# Altium project cat.PrjPcb (part 2 of 6)

## Sheet radios.SchDoc: Microcontroller
size A3; SheetNumber: 2; SheetTotal: 7
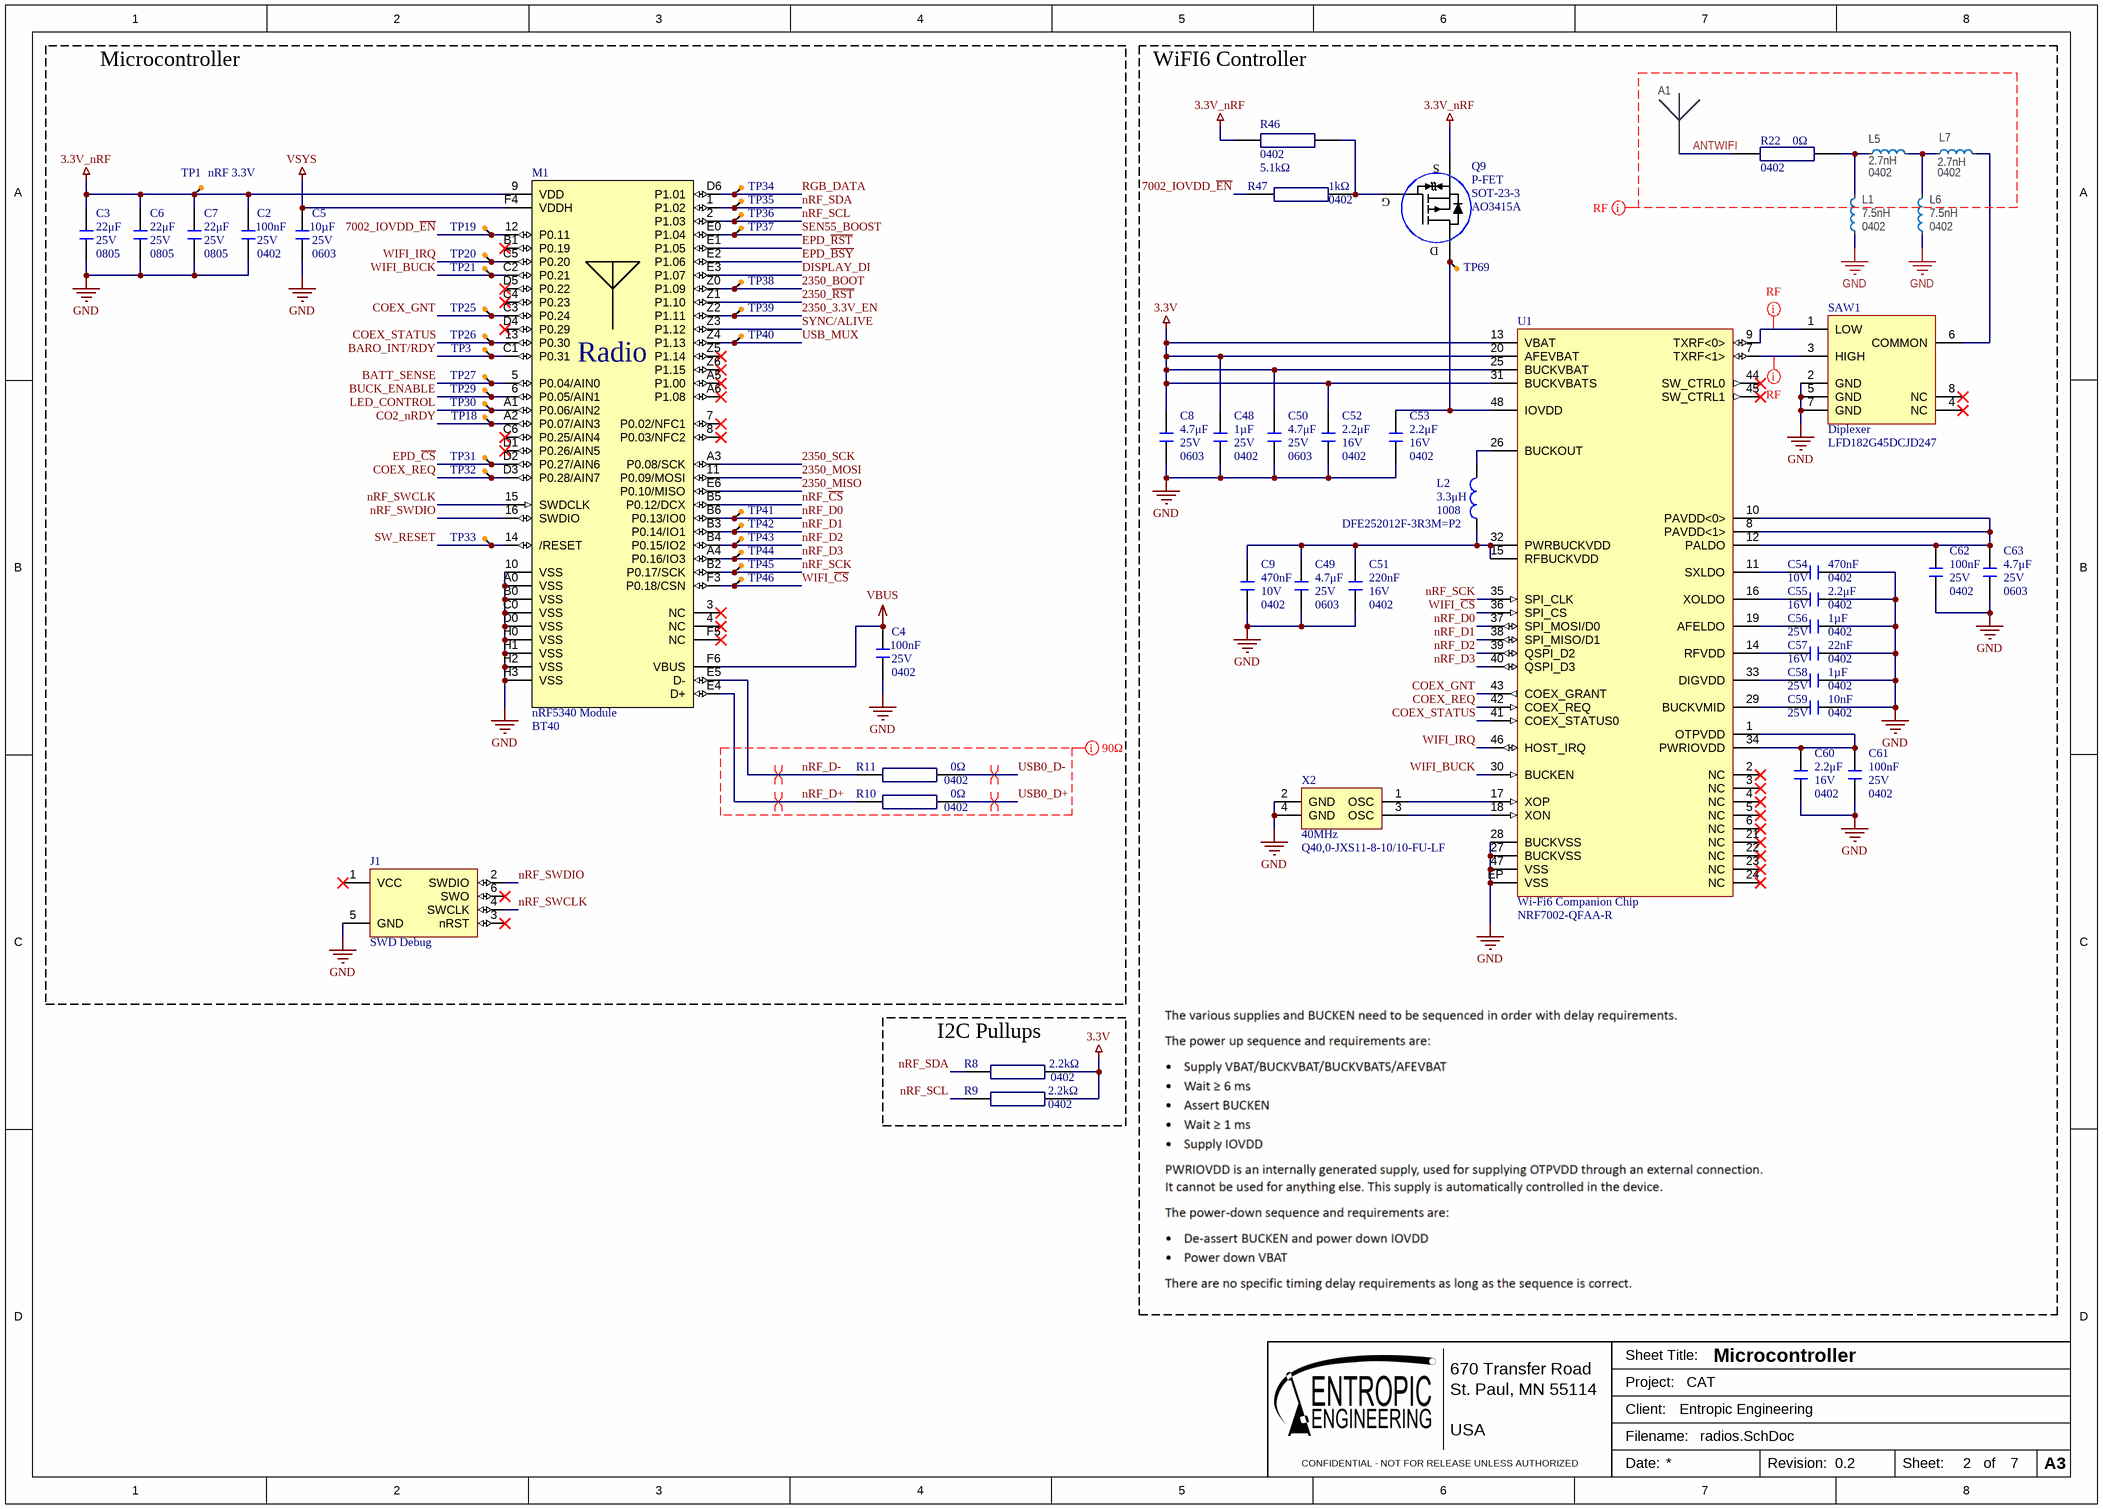
[diagram p1: radios.SchDoc]

### Parts
A1  (no value)  [NN03-320]
C2  Voltage Rating: 25V  Case Code (Imperial): 0402  Capacitance: 100nF  [0402_capacitor]  (hidden comment: GRM155R71E104KE14D)
C3  value 22μF  Rated DC Voltage (URdc): 25V  Case/Package: 0805  [0805_capacitor]  (hidden comment: GRT21BR61E226ME13L)
C4  Voltage Rating: 25V  Case Code (Imperial): 0402  Capacitance: 100nF  [0402_capacitor]  (hidden comment: GRM155R71E104KE14D)
C5  value 10µF  Voltage Rating: 25V  Case Code (Imperial): 0603  [0603_capacitor]  (hidden comment: CL10A106MA8NRNC)
C6  value 22μF  Rated DC Voltage (URdc): 25V  Case/Package: 0805  [0805_capacitor]  (hidden comment: GRT21BR61E226ME13L)
C7  value 22μF  Rated DC Voltage (URdc): 25V  Case/Package: 0805  [0805_capacitor]  (hidden comment: GRT21BR61E226ME13L)
C8  value 4.7μF  Voltage Rating: 25V  Case/Package: 0603  [0603_capacitor]  (hidden comment: C1608X5R1E475K080AC)
C9  Capacitance: 470nF  Voltage Rating: 10V  Case/Package: 0402  [0402_capacitor]  (hidden comment: CL05Y474KP5VPJC)
C48  Size Code: 0402  Capacitance: 1µF  Voltage: 25V  [0402_capacitor]  (hidden comment: GRM155R61E105KA12D)
C49  value 4.7μF  Voltage Rating: 25V  Case/Package: 0603  [0603_capacitor]  (hidden comment: C1608X5R1E475K080AC)
C50  value 4.7μF  Voltage Rating: 25V  Case/Package: 0603  [0603_capacitor]  (hidden comment: C1608X5R1E475K080AC)
C51  value 220nF  Voltage Rating: 16V  Case/Package: 0402  [0402_capacitor]  (hidden comment: GCM155R71C224KE02D)
C52  value 2.2μF  Voltage Rating: 16V  Case/Package: 0402  [0402_capacitor]  (hidden comment: GRM155D71C225ME11D)
C53  value 2.2μF  Voltage Rating: 16V  Case/Package: 0402  [0402_capacitor]  (hidden comment: GRM155D71C225ME11D)
C54  Capacitance: 470nF  Voltage Rating: 10V  Case/Package: 0402  [0402_capacitor]  (hidden comment: CL05Y474KP5VPJC)
C55  value 2.2μF  Voltage Rating: 16V  Case/Package: 0402  [0402_capacitor]  (hidden comment: GRM155D71C225ME11D)
C56  Size Code: 0402  Capacitance: 1µF  Voltage: 25V  [0402_capacitor]  (hidden comment: GRM155R61E105KA12D)
C57  value 22nF  Voltage Rating: 16V  Case/Package: 0402  [0402_capacitor]  (hidden comment: C0402C223K4RECAUTO)
C58  Size Code: 0402  Capacitance: 1µF  Voltage: 25V  [0402_capacitor]  (hidden comment: GRM155R61E105KA12D)
C59  Capacitance: 10nF  Voltage Rating: 25V  Case Code (Imperial): 0402  [0402_capacitor]  (hidden comment: CL05B103KA5NNNC)
C60  value 2.2μF  Voltage Rating: 16V  Case/Package: 0402  [0402_capacitor]  (hidden comment: GRM155D71C225ME11D)
C61  Case Code (Imperial): 0402  Voltage: 25V  Capacitance: 100nF  [0402_capacitor]  (hidden comment: GRM155R71E104KE14D)
C62  Case Code (Imperial): 0402  Voltage: 25V  Capacitance: 100nF  [0402_capacitor]  (hidden comment: GRM155R71E104KE14D)
C63  value 4.7μF  Voltage Rating: 25V  Case/Package: 0603  [0603_capacitor]  (hidden comment: C1608X5R1E475K080AC)
J1  SWD Debug  [debug_header_dual]  (no BOM)
L1  value 7.5nH  Footprint Doc: 0402  [INDC1005X04L]
L2  value 3.3μH  Case Code (Imperial): 1008  [INDC2520X12N]  (hidden comment: DFE252012F-3R3M=P2)
L5  value 2.7nH  Footprint Doc: 0402  [INDC1005X04L]
L6  value 7.5nH  Footprint Doc: 0402  [INDC1005X04L]
L7  value 2.7nH  Footprint Doc: 0402  [INDC1005X04L]
M1  nRF5340 Module  [BT40]
Q9  P-FET  Case/Package: SOT-23-3  [SOT95P280X115-3N]
R8  value 2.2kΩ  Case/Package: 0402  [0402_resistor]  (hidden comment: RC0402FR-072K2L)
R9  value 2.2kΩ  Case/Package: 0402  [0402_resistor]  (hidden comment: RC0402FR-072K2L)
R10  value 0Ω  Case/Package: 0402  [0402_resistor]  (hidden comment: RC0402FR-070RL)
R11  value 0Ω  Case/Package: 0402  [0402_resistor]  (hidden comment: RC0402FR-070RL)
R22  value 0Ω  Case/Package: 0402  [0402_resistor]  (hidden comment: RC0402FR-070RL)
R46  value 5.1kΩ  Case/Package: 0402  [0402_resistor]  (hidden comment: RC0402FR-075K1L)
R47  value 1kΩ  Case/Package: 0402  [0402_resistor]  (hidden comment: RC0402JR-071KL)
SAW1  Diplexer  [CAF-50P160X80-6N]
TP1  nRF 3.3V  [test_point-1]  (no BOM)
TP3  test_point-1  [test_point-1]  (value not drawn)  (no BOM)
TP18  test_point-1  [test_point-1]  (value not drawn)  (no BOM)
TP19  test_point-1  [test_point-1]  (value not drawn)  (no BOM)
TP20  test_point-1  [test_point-1]  (value not drawn)  (no BOM)
TP21  test_point-1  [test_point-1]  (value not drawn)  (no BOM)
TP25  test_point-1  [test_point-1]  (value not drawn)  (no BOM)
TP26  test_point-1  [test_point-1]  (value not drawn)  (no BOM)
TP27  test_point-1  [test_point-1]  (value not drawn)  (no BOM)
TP29  test_point-1  [test_point-1]  (value not drawn)  (no BOM)
TP30  test_point-1  [test_point-1]  (value not drawn)  (no BOM)
TP31  (no value)  [test_point-1]  (no BOM)
TP32  test_point-1  [test_point-1]  (value not drawn)  (no BOM)
TP33  test_point-1  [test_point-1]  (value not drawn)  (no BOM)
TP34  test_point-1  [test_point-1]  (value not drawn)  (no BOM)
TP35  test_point-1  [test_point-1]  (value not drawn)  (no BOM)
TP36  test_point-1  [test_point-1]  (value not drawn)  (no BOM)
TP37  test_point-1  [test_point-1]  (value not drawn)  (no BOM)
TP38  test_point-1  [test_point-1]  (value not drawn)  (no BOM)
TP39  test_point-1  [test_point-1]  (value not drawn)  (no BOM)
TP40  test_point-1  [test_point-1]  (value not drawn)  (no BOM)
TP41  test_point-1  [test_point-1]  (value not drawn)  (no BOM)
TP42  test_point-1  [test_point-1]  (value not drawn)  (no BOM)
TP43  test_point-1  [test_point-1]  (value not drawn)  (no BOM)
TP44  test_point-1  [test_point-1]  (value not drawn)  (no BOM)
TP45  test_point-1  [test_point-1]  (value not drawn)  (no BOM)
TP46  test_point-1  [test_point-1]  (value not drawn)  (no BOM)
TP69  nRF IOVDD  [test_point-1]  (value not drawn)  (no BOM)
U1  Wi-Fi6 Companion Chip  [QFN40P600X600X60-48N]
X2  40MHz  [1612_CRYSTAL]

### Blocks framed on the sheet
Microcontroller: C2-C7 J1 M1 R10 R11 TP1 TP3 TP18-TP21 TP25-TP27 TP29-TP46
WiFI6 Controller: A1 C8 C9 C48-C63 L1 L2 L5-L7 Q9 R22 R46 R47 SAW1 TP69 U1 X2
I2C Pullups: R8 R9

### Nets
3.3V: C8.2 C48.2 C50.2 C52.2 R8.1 R9.1 U1.13(VBAT) U1.20(AFEVBAT) U1.25(BUCKVBAT) U1.31(BUCKVBATS)
3.3V_nRF: C2.1 C3.2 C6.2 C7.2 M1.9(VDD) Q9.2(S) R46.2 TP1.1
GND: C2.2 C3.1 C4.2 C5.1 C6.1 C7.1 C8.1 C9.2 C48.1 C49.1 C50.1 C51.1 C52.1 C53.1 C54.1 C55.1 C56.1 C57.2 C58.1 C59.1 C60.1 C61.2 C62.2 C63.1 J1.5(GND) L1.1 L6.1 M1.10(VSS) M1.A0(VSS) M1.B0(VSS) M1.C0(VSS) M1.D0(VSS) M1.H0(VSS) M1.H1(VSS) M1.H2(VSS) M1.H3(VSS) SAW1.2(GND) SAW1.5(GND) SAW1.7(GND) U1.27(BUCKVSS) U1.28(BUCKVSS) U1.47(VSS) U1.EP(VSS) X2.2(GND) X2.4(GND)
VBUS: C4.1 M1.F6(VBUS)
VSYS: C5.2 M1.F4(VDDH)
2350_3.3V_EN: M1.Z2(P1.11) TP39.1
2350_BOOT: M1.Z0(P1.09) TP38.1
2350_MISO: M1.E6(P0.10/MISO)
2350_MOSI: M1.11(P0.09/MOSI)
2350_~{RST}: M1.Z1(P1.10)
2350_SCK: M1.A3(P0.08/SCK)
7002_IOVDD_~{EN}: M1.12(P0.11) R47.1 TP19.1
ANTWIFI: A1.4(Feed1) R22.2
BARO_INT/RDY: M1.C1(P0.31) TP3.1
BATT_SENSE: M1.5(P0.04/AIN0) TP27.1
BUCK_ENABLE: M1.6(P0.05/AIN1) TP29.1
CO2_nRDY: M1.A2(P0.07/AIN3) TP18.1
COEX_GNT: M1.C3(P0.24) TP25.1 U1.43(COEX_GRANT)
COEX_REQ: M1.D3(P0.28/AIN7) TP32.1 U1.42(COEX_REQ)
COEX_STATUS: M1.13(P0.30) TP26.1 U1.41(COEX_STATUS0)
DISPLAY_DI: M1.E3(P1.07)
EPD_~{BSY}: M1.E2(P1.06)
EPD_~{CS}: M1.D2(P0.27/AIN6) TP31.1
EPD_~{RST}: M1.E1(P1.05)
LED_CONTROL: M1.A1(P0.06/AIN2) TP30.1
nRF_~{CS}: M1.B5(P0.12/DCX)
nRF_D0: M1.B6(P0.13/IO0) TP41.1 U1.37(SPI_MOSI/D0)
nRF_D1: M1.B3(P0.14/IO1) TP42.1 U1.38(SPI_MISO/D1)
nRF_D2: M1.B4(P0.15/IO2) TP43.1 U1.39(QSPI_D2)
nRF_D3: M1.A4(P0.16/IO3) TP44.1 U1.40(QSPI_D3)
nRF_D+: M1.E4(D+) R10.2
nRF_D-: M1.E5(D-) R11.2
nRF_SCK: M1.B2(P0.17/SCK) TP45.1 U1.35(SPI_CLK)
nRF_SCL: M1.2(P1.03) R9.2 TP36.1
nRF_SDA: M1.1(P1.02) R8.2 TP35.1
nRF_SWCLK: J1.4(SWCLK) M1.15(SWDCLK)
nRF_SWDIO: J1.2(SWDIO) M1.16(SWDIO)
RGB_DATA: M1.D6(P1.01) TP34.1
SEN55_BOOST: M1.E0(P1.04) TP37.1
SW_RESET: M1.14(/RESET) TP33.1
SYNC/ALIVE: M1.Z3(P1.12)
USB0_D+: R10.1
USB0_D-: R11.1
USB_MUX: M1.Z4(P1.13) TP40.1
WIFI_BUCK: M1.C2(P0.21) TP21.1 U1.30(BUCKEN)
WIFI_~{CS}: M1.F3(P0.18/CSN) TP46.1 U1.36(SPI_CS)
WIFI_IRQ: M1.C5(P0.20) TP20.1 U1.46(HOST_IRQ)
NetC9_1: C9.1 C49.2 C51.2 L2.1 U1.15(RFBUCKVDD) U1.32(PWRBUCKVDD)
NetC53_2: C53.2 Q9.3(D) TP69.1 U1.48(IOVDD)
NetC54_2: C54.2 U1.11(SXLDO)
NetC55_2: C55.2 U1.16(XOLDO)
NetC56_2: C56.2 U1.19(AFELDO)
NetC57_1: C57.1 U1.14(RFVDD)
NetC58_2: C58.2 U1.33(DIGVDD)
NetC59_2: C59.2 U1.29(BUCKVMID)
NetC60_2: C60.2 C61.1 U1.1(OTPVDD) U1.34(PWRIOVDD)
NetC62_1: C62.1 C63.2 U1.8(PAVDD<1>) U1.10(PAVDD<0>) U1.12(PALDO)
NetL1_2: L1.2 L5.1 R22.1
NetL2_2: L2.2 U1.26(BUCKOUT)
NetL5_2: L5.2 L6.2 L7.1
NetL7_2: L7.2 SAW1.6(COMMON)
NetQ9_1: Q9.1(G) R46.1 R47.2
NetSAW1_1: SAW1.1(LOW) U1.9(TXRF<0>)
NetSAW1_3: SAW1.3(HIGH) U1.7(TXRF<1>)
NetU1_17: U1.17(XOP) X2.1(OSC)
NetU1_18: U1.18(XON) X2.3(OSC)

Not connected (* = marked no-connect by the designer): A1 1(NC) 2(GND) 3(Feed2); J1 1(VCC)* 3(nRST)* 6(SWO)*; M1 3(NC)* 4(NC)* 7(P0.02/NFC1)* 8(P0.03/NFC2)* A5(P1.00)* A6(P1.08)* B1(P0.19)* C4(P0.23)* C6(P0.25/AIN4)* D1(P0.26/AIN5)* D4(P0.29)* D5(P0.22)* F5(NC)* Z5(P1.14)* Z6(P1.15)*; SAW1 4(NC)* 8(NC)*; U1 2(NC)* 3(NC)* 4(NC)* 5(NC)* 6(NC)* 21(NC)* 22(NC)* 23(NC)* 24(NC)* 44(SW_CTRL0)* 45(SW_CTRL1)*

### Layout directives
differential pair; differential pair class USB_DIFF: nRF_D+, nRF_D-, USB0_D+, USB0_D-
net class 90_OHM: nRF_D+, nRF_D-, USB0_D+, USB0_D-
net class RF: ANTWIFI, NetSAW1_1, NetSAW1_3

### Notes on the sheet
- 670 Transfer Road
- St. Paul, MN 55114
- Sheet Title:
- Project:
- CONFIDENTIAL - NOT FOR RELEASE UNLESS AUTHORIZED
- USA
- Client:
- Filename:
- Date:
- Revision:
- Sheet:
- of
- A3
- (in symbol BT40) Radio

### Library data of the parts
A1 = NN03-320: Dual-Band GNSS and Wi-Fi/BluetoothAntenna; Manufacturer: Ignion; Part number NEMS: 100700066; Component Status: Active; Pad Count: 4; Note: N.A.; Part Number: NN03-320; Component Class: Antennas; Author: rubr; Manufacturer Part Number: NN03-320; ComponentLink1URL: https://ignion.io/files/DS_NN03-320.pdf; ComponentLink1Description: Datasheet; ComponentLink2URL: https://ignion.io/product/duo-mxtend/; ComponentLink2Description: Supplier link; HelpURL: https://ignion.io/files/UM_NN03-320.pdf; LatestRevisionDate: 2021-12-10; Published: 2023-01-31; Footprint Doc: NN03-320; Value: NN03-320; Supplier 1: Digi-Key; Supplier Part Number 1: 2115-NN03-320CT-ND; Supplier 2: Mouser; Supplier Part Number 2: 128-NN03-320; Artikkelnr Noca: N.A.; Part number IPS: N.A.; Part number Norautron: N.A.; PartId: 100700066
C2 C4 = GRM155R71E104KE14D: 100 nF, 25 V, X7R, 0402 Chip capacitor; Manufacturer: Murata; house_part_number: C-100nF-0402-002; Tolerance: 10%; Dielectric Material: Ceramic; Supplier 1: Digi-Key; Supplier Part Number 1: 490-10698-1-ND; RoHS: Yes; Category: Ceramic Capacitors; Case/Package: 0402; Case Code (Metric): 1005; Min Operating Temperature: -55°C; Max Operating Temperature: 125°C; Packaging: Tape and Reel; RoHS Compliant: Yes; ComponentLink1URL: http://www.farnell.com/datasheets/1872206.pdf?src-supplier=Farnell; ComponentLink1Description: http://www.farnell.com/datasheets/1872206.pdf?src-supplier=Farnell; Manufacturer Part Number: GRM155R71E104KE14D; Height: 0.5mm; Lead Free: Lead Free; Pricing 1: 1=0.10000, 10=0.02700, 50=0.01460, 100=0.01190, 500=0.00848, 1000=0.00666, 2500=0.00605, 5000=0.00557 (USD); Mount: Surface Mount; Weight: 0.000212oz; Dielectric: X7R; Termination: SMD/SMT; Resistor Type: Ceramic; Voltage Rating (DC): 25V; Package Quantity: 10000; Length: 1mm; Width: 0.02inch; Thickness: 0.022inch; Depth: 0.5mm; REACH SVHC: Unknown; ComponentLink2URL: http://components.arrow.com/part/dataview/0323_06361249?src-supplier=Arrow+Europe; ComponentLink2Description: http://components.arrow.com/part/dataview/0323_06361249?src-supplier=Arrow+Europe; ComponentLink3URL: http://uk.rs-online.com/webdocs/144c/0900766b8144c113.pdf?src-supplier=RSComponents; ComponentLink3Description: http://uk.rs-online.com/webdocs/144c/0900766b8144c113.pdf?src-supplier=RSComponents; ComponentLink4URL: http://www.farnell.com/datasheets/2048008.pdf?src-supplier=Farnell; ComponentLink4Description: http://www.farnell.com/datasheets/2048008.pdf?src-supplier=Farnell; ComponentLink5URL: http://www.mouser.com/ds/2/281/c02e-2905.pdf?src-supplier=Mouser; ComponentLink5Description: http://www.mouser.com/ds/2/281/c02e-2905.pdf?src-supplier=Mouser; ComponentLink6URL: http://www.farnell.com/datasheets/2048008.pdf?src-supplier=Newark; ComponentLink6Description: http://www.farnell.com/datasheets/2048008.pdf?src-supplier=Newark; ComponentLink7URL: https://search.murata.co.jp/Ceramy/image/img/A01X/G101/ENG/GRM155R71E104KE14-01.pdf?src-supplier=Digi-Key; ComponentLink7Description: https://search.murata.co.jp/Ceramy/image/img/A01X/G101/ENG/GRM155R71E104KE14-01.pdf?src-supplier=Digi-Key; ComponentLink8URL: http://www.farnell.com/datasheets/2048008.pdf?src-supplier=Element14; ComponentLink8Description: http://www.farnell.com/datasheets/2048008.pdf?src-supplier=Element14; ComponentLink9URL: http://psearch.en.murata.com/capacitor/product/GRM155R71E104KE14%23.pdf?src-supplier=Avnet; ComponentLink9Description: http://psearch.en.murata.com/capacitor/product/GRM155R71E104KE14%23.pdf?src-supplier=Avnet
C3 C6 C7 = GRT21BR61E226ME13L: 22 μF, 25 V, X5R, 0805 Chip capacitor; Manufacturer: Murata; Dielectric Material: Ceramic; Multilayer: Yes; Tolerance  (fill in as +-): 20%; Reference Standard: AEC-Q200; Supplier 1: Digi-Key; RoHS: Yes; Category: Ceramic Capacitors; Stock 1: 1983731; Pricing 1: 1=0.48, 10=0.338, 50=0.2558, 100=0.2228, 500=0.16508, 1000=0.14031 (USD); Mounting Technology: Surface Mount; Pins: 2; Package Shape: Rectangular; Terminal Finish: Nickel; Min Operating Temperature: -55°C; Max Operating Temperature: 85°C; JESD-609 Code: e3; Capacitor Type: Ceramic; Packaging: Tape and Reel; Tolerance (fill in as +-): 20%; Temperature Characteristics Code: X5R; Termination: Wraparound; Reach SVHC Compliant: Yes; RoHS Compliant: Yes; ComponentLink1URL: https://datasheet.ciiva.com:443/pdfs/VipMasterIC/IC/MURE/MURE-S-A0004410517/MURE-S-A0004413512-1.pdf?src-supplier=IHS+Markit; ComponentLink1Description: https://datasheet.ciiva.com:443/pdfs/VipMasterIC/IC/MURE/MURE-S-A0004410517/MURE-S-A0004413512-1.pdf?src-supplier=IHS+Markit; ComponentLink2URL: http://search.murata.co.jp/Ceramy/image/img/A01X/G101/ENG/GRT21BR61E226ME13-01.pdf?src-supplier=Digi-Key; ComponentLink2Description: http://search.murata.co.jp/Ceramy/image/img/A01X/G101/ENG/GRT21BR61E226ME13-01.pdf?src-supplier=Digi-Key; Manufacturer Part Number: GRT21BR61E226ME13L; Supplier Part Number 1: 490-12389-1-ND
C5 = CL10A106MA8NRNC: 10 µF, 25 V, X5R, 0603 Chip capacitor; Manufacturer: Samsung; house_part_number: C-10uF-0603-002; Tolerance: 20%; Material: 4241ConductorMaterial; Supplier 1: Arrow Electronics; Supplier Part Number 1: CL10A106MA8NRNC; RoHS: Yes; Category: Ceramic Capacitors; Case/Package: 0603; Case Code (Metric): 1608; Min Operating Temperature: -55°C; Max Operating Temperature: 85°C; Packaging: Cut Tape; RoHS Compliant: Yes; ComponentLink1URL: https://datasheet.ciiva.com/25766/cl10a106ma8nrnc-25766562.pdf?src-supplier=Digikey; ComponentLink1Description: https://datasheet.ciiva.com/25766/cl10a106ma8nrnc-25766562.pdf?src-supplier=Digikey; Manufacturer Part Number: CL10A106MA8NRNC; Stock: 632000; Pricing: 4000=0.0511, 8000=0.046, 12000=0.0434, 28000=0.0413, 100000=0.0356 (USD); Mounting Technology: Surface Mount; Series: CL; Height: 900um; Lead Free: Lead Free
C8 C49 C50 C63 = C1608X5R1E475K080AC: 4.7 μF, 25 V, X7R, 0603 Chip capacitor; Manufacturer: TDK; Material: Ceramic; Tolerance: 10%; Dielectric: X5R; Manufacturer Part Number: C1608X5R1E475K080AC; RoHS: Yes; Category: Ceramic Capacitors; Stock: 1983872; Pricing: 1=0.16, 10=0.104, 50=0.0732, 100=0.0592, 500=0.04396, 1000=0.03847, 4000=0.03389, 8000=0.03225 (USD); Mounting Technology: Surface Mount; Case Code (Metric): 1608; Case Code (Imperial): 0603; Min Operating Temperature: -55°C; Max Operating Temperature: 85°C; Packaging: Tape and Reel; Package Quantity: 4000; Series: C; Construction: Flat; Length: 1.6mm; Width: 0.031inch; Height: 0.8mm; Thickness: 0.039inch; Depth: 0.8mm; RoHS Compliant: Yes; Lead Free: Lead Free; ComponentLink1URL: https://datasheet.ciiva.com/48671/mlcc-commercial-general-en-48671304.pdf?src-supplier=Avnet; ComponentLink1Description: https://datasheet.ciiva.com/48671/mlcc-commercial-general-en-48671304.pdf?src-supplier=Avnet; ComponentLink2URL: https://datasheet.ciiva.com/24216/mlcc-commercial-general-en-24216326.pdf?src-supplier=Mouser; ComponentLink2Description: https://datasheet.ciiva.com/24216/mlcc-commercial-general-en-24216326.pdf?src-supplier=Mouser; Supplier: Digikey; Supplier Part Number: 445-9050-1-ND; Weight: 7.1E-05oz; Dielectric Material: Ceramic; Voltage Rating (DC): 25V; Termination: SMD/SMT; Reach SVHC Compliant: Unknown; ComponentLink3URL: https://datasheet.ciiva.com/48587/6print-detail-pdf-phplangenpart-noc1608x5r1e475k080acimp-unit-xmhz-48587141.pdf?src-supplier=Onlinecomponents.com; ComponentLink3Description: https://datasheet.ciiva.com/48587/6print-detail-pdf-phplangenpart-noc1608x5r1e475k080acimp-unit-xmhz-48587141.pdf?src-supplier=Onlinecomponents.com
C9 C54 = CL05Y474KP5VPJC: 470 nF, 10 V, X7S, 0402 Chip capacitor; Manufacturer: Samsung; Supplier: Digikey; Supplier Part Number: 1276-CL05Y474KP5VPJCCT-ND; Manufacturer Part Number: CL05Y474KP5VPJC; RoHS: No; Category: Ceramic Capacitors; Stock: 27105; Pricing: 1=0.23, 10=0.15, 50=0.105, 100=0.0848, 500=0.06298, 1000=0.0551, 2500=0.05248, 5000=0.04854 (USD)
C48 C56 C58 = GRM155R61E105KA12D: 1 µF, 25 V, X5R, 0402 Chip capacitor; Manufacturer: Murata; house_part_number: C-1uF-0402-002; Dielectric Material: Ceramic; Multilayer: Yes; Negative Tolerance: 10%; Supplier 1: Digi-Key; Supplier Part Number 1: 490-10017-1-ND; RoHS: Yes; Category: Ceramic Capacitors; Stock 1: 145965; Pricing 1: 1=0.11000, 10=0.08300, 50=0.04560, 100=0.03720, 500=0.02656, 1000=0.02087, 2500=0.01898, 5000=0.01746 (USD); Mount: Surface Mount; Number of Pins: 2; Package Shape: Rectangular; Terminal Finish: Nickel; Min Operating Temperature: -55°C; Max Operating Temperature: 85°C; JESD-609 Code: e3; Capacitor Type: Ceramic; Package Style: SMTMeter; Packaging: Tape and Reel; Positive Tolerance: 10%; Temperature Characteristics Code: X5R; Termination: Wraparound; Length: 1mm; Width: 0.5mm; Height: 0.5mm; REACH SVHC: Yes; RoHS Compliant: Yes; ComponentLink1URL: https://datasheet.ciiva.com:443/pdfs/VipMasterIC/IC/MURE/MURE-S-A0004362469/MURE-S-A0004364524-1.pdf?src-supplier=IHS+Markit; ComponentLink1Description: https://datasheet.ciiva.com:443/pdfs/VipMasterIC/IC/MURE/MURE-S-A0004362469/MURE-S-A0004364524-1.pdf?src-supplier=IHS+Markit; ComponentLink2URL: https://datasheet.ciiva.com/7719/1666664-7719006.pdf?src-supplier=Element14; ComponentLink2Description: https://datasheet.ciiva.com/7719/1666664-7719006.pdf?src-supplier=Element14; ComponentLink3URL: https://datasheet.ciiva.com/22732/1666664-22732122.pdf?src-supplier=Element14; ComponentLink3Description: https://datasheet.ciiva.com/22732/1666664-22732122.pdf?src-supplier=Element14; Manufacturer Part Number: GRM155R61E105KA12D
C51 = GCM155R71C224KE02D: 220 nF, 16 V, X7R, 0402 Chip capacitor; Manufacturer: Murata; Material: Ceramic; Tolerance: 10%; Supplier: Future Electronics; Supplier Part Number: 7050660; Manufacturer Part Number: GCM155R71C224KE02D; RoHS: Yes; Category: Ceramic Capacitors; Stock: 80000; Pricing: 10000=0.0082, 30000=0.0079, 50000=0.0078, 150000=0.0076, 250000=0.0074 (USD); Mounting Technology: Surface Mount; Case Code (Metric): 1005; Case Code (Imperial): 0402; Weight: 0.000212oz; Min Operating Temperature: -55°C; Max Operating Temperature: 125°C; Packaging: Tape and Reel; Dielectric: X7R; Termination: SMD/SMT; Voltage Rating (DC): 16V; Package Quantity: 10000; Series: GCM; Length: 0.039inch; Width: 0.02inch; Height: 0.5mm; Thickness: 0.022inch; Ratings: AEC-Q200; Lead Free: Lead Free; RoHS Compliant: Yes; ComponentLink1URL: http://www.mouser.com/ds/2/281/c03e-806517.pdf?src-supplier=Mouser; ComponentLink1Description: http://www.mouser.com/ds/2/281/c03e-806517.pdf?src-supplier=Mouser; ComponentLink2URL: http://search.murata.co.jp/Ceramy/image/img/A01X/partnumbering_e_02.pdf?src-supplier=Digikey; ComponentLink2Description: http://search.murata.co.jp/Ceramy/image/img/A01X/partnumbering_e_02.pdf?src-supplier=Digikey; ComponentLink3URL: https://datasheet.octopart.com/GCM155R71C224KE02D-Murata-datasheet-32042419.pdf?src-supplier=Future+Electronics; ComponentLink3Description: https://datasheet.octopart.com/GCM155R71C224KE02D-Murata-datasheet-32042419.pdf?src-supplier=Future+Electronics; ComponentLink4URL: https://datasheet.octopart.com/GCM155R71C224KE02D-Murata-datasheet-149522429.pdf?src-supplier=Newark; ComponentLink4Description: https://datasheet.octopart.com/GCM155R71C224KE02D-Murata-datasheet-149522429.pdf?src-supplier=Newark; ComponentLink5URL: https://datasheet.octopart.com/GCM155R71C224KE02D-Murata-datasheet-12511495.pdf?src-supplier=TME; ComponentLink5Description: https://datasheet.octopart.com/GCM155R71C224KE02D-Murata-datasheet-12511495.pdf?src-supplier=TME
C52 C53 C55 C60 = GRM155D71C225ME11D: 2.2 µF, 16 V, X7T, 0402 Chip capacitor; Manufacturer: Murata; Material: Ceramic; Tolerance: 20%; Supplier: Future Electronics; Supplier Part Number: 9135167; Manufacturer Part Number: GRM155D71C225ME11D; RoHS: Yes; Category: Ceramic Capacitors; Stock: 10000; Pricing: 10000=0.0274, 20000=0.027, 30000=0.0267, 40000=0.0266, 50000=0.026 (USD); Min Operating Temperature: -55°C; Max Operating Temperature: 125°C; Dielectric: X7T; Voltage Rating (DC): 16V; Length: 1mm; Width: 500um; Height: 650um; Thickness: 500um; RoHS Compliant: Yes; ComponentLink1URL: https://datasheet.octopart.com/GRM155D71C225ME11D-Murata-datasheet-165579666.pdf?src-supplier=TME; ComponentLink1Description: https://datasheet.octopart.com/GRM155D71C225ME11D-Murata-datasheet-165579666.pdf?src-supplier=TME
C57 = C0402C223K4RECAUTO: 22 nF, 16 V, X7R, 0402 Chip capacitor; Manufacturer: KEMET; Tolerance: 10%; Supplier: Mouser; Supplier Part Number: 80-C0402C223K4RECAUT; Manufacturer Part Number: C0402C223K4RECAUTO; RoHS: Yes; Category: Ceramic Capacitors; Stock: 25248; Pricing: 1=0.13, 10=0.054, 50=0.054, 100=0.031, 1000=0.027, 10000=0.023 (USD); Mounting Technology: Surface Mount; Case Code (Imperial): 0402; Case Code (Metric): 1005; Min Operating Temperature: -55°C; Max Operating Temperature: 125°C; Packaging: Cut Tape; Series: C; Dielectric: X7R; Voltage Rating (DC): 16V; Ratings: AEC-Q200; RoHS Compliant: Yes; ComponentLink1URL: https://api.kemet.com/component-edge/download/datasheet/C0402C223K4RECAUTO.pdf?src-supplier=Digikey; ComponentLink1Description: https://api.kemet.com/component-edge/download/datasheet/C0402C223K4RECAUTO.pdf?src-supplier=Digikey; ComponentLink2URL: https://datasheet.octopart.com/C0402C223K4RECAUTO-KEMET-datasheet-153706760.pdf?src-supplier=Electro+Sonic; ComponentLink2Description: https://datasheet.octopart.com/C0402C223K4RECAUTO-KEMET-datasheet-153706760.pdf?src-supplier=Electro+Sonic
C59 = CL05B103KA5NNNC: 10 nF, 25 V, X7R, 0402 Chip capacitor; Manufacturer: Samsung; house_part_number: C-10nF-0402-002; Tolerance: 10%; Supplier 1: Digi-Key; Supplier Part Number 1: 1276-1057-2-ND; RoHS: Yes; Category: Ceramic Capacitors; Stock 1: 2318300; Pricing 1: 10000=0.00328, 20000=0.00312, 30000=0.00297, 50000=0.00266, 100000=0.00215, 250000=0.00195 (USD); Mount: Surface Mount; Case/Package: 0402; Case Code (Metric): 1005; Contact Plating: Tin; Min Operating Temperature: -55°C; Max Operating Temperature: 125°C; Packaging: Tape and Reel; Package Quantity: 1; Dielectric: X7R; Series: CL; Construction: Flat; Length: 1mm; Width: 0.02inch; Height: 0.5mm; Thickness: 0.022inch; Depth: 0.5mm; Radiation Hardening: No; RoHS Compliant: Yes; ComponentLink1URL: https://datasheet.ciiva.com/15195/getdatasheetpartid-358612-15195635.pdf?src-supplier=Verical; ComponentLink1Description: https://datasheet.ciiva.com/15195/getdatasheetpartid-358612-15195635.pdf?src-supplier=Verical; ComponentLink2URL: https://datasheet.ciiva.com/16740/cl05b104kq5nnnc-16740683.pdf?src-supplier=Future+Electronics; ComponentLink2Description: https://datasheet.ciiva.com/16740/cl05b104kq5nnnc-16740683.pdf?src-supplier=Future+Electronics; Manufacturer Part Number: CL05B103KA5NNNC
C61 C62 = GRM155R71E104KE14D: 100 nF, 25 V, X7R, 0402 Chip capacitor; Manufacturer: Murata; house_part_number: C-100nF-0402-002; Dielectric Material: Ceramic; Tolerance: 10%; Supplier 1: Digi-Key; Supplier Part Number 1: 490-10698-1-ND; RoHS: Yes; Category: Ceramic Capacitors; Pricing 1: 1=0.10000, 10=0.02700, 50=0.01460, 100=0.01190, 500=0.00848, 1000=0.00666, 2500=0.00605, 5000=0.00557 (USD); Mount: Surface Mount; Case/Package: 0402; Case Code (Metric): 1005; Weight: 0.000212oz; Min Operating Temperature: -55°C; Max Operating Temperature: 125°C; Packaging: Tape and Reel; Voltage Rating: 25V; Dielectric: X7R; Termination: SMD/SMT; Resistor Type: Ceramic; Voltage Rating (DC): 25V; Package Quantity: 10000; Length: 1mm; Width: 0.02inch; Height: 0.5mm; Thickness: 0.022inch; Depth: 0.5mm; REACH SVHC: Unknown; Lead Free: Lead Free; RoHS Compliant: Yes; ComponentLink1URL: http://www.farnell.com/datasheets/1872206.pdf?src-supplier=Farnell; ComponentLink1Description: http://www.farnell.com/datasheets/1872206.pdf?src-supplier=Farnell; ComponentLink2URL: http://components.arrow.com/part/dataview/0323_06361249?src-supplier=Arrow+Europe; ComponentLink2Description: http://components.arrow.com/part/dataview/0323_06361249?src-supplier=Arrow+Europe; ComponentLink3URL: http://uk.rs-online.com/webdocs/144c/0900766b8144c113.pdf?src-supplier=RSComponents; ComponentLink3Description: http://uk.rs-online.com/webdocs/144c/0900766b8144c113.pdf?src-supplier=RSComponents; ComponentLink4URL: http://www.farnell.com/datasheets/2048008.pdf?src-supplier=Farnell; ComponentLink4Description: http://www.farnell.com/datasheets/2048008.pdf?src-supplier=Farnell; ComponentLink5URL: http://www.mouser.com/ds/2/281/c02e-2905.pdf?src-supplier=Mouser; ComponentLink5Description: http://www.mouser.com/ds/2/281/c02e-2905.pdf?src-supplier=Mouser; ComponentLink6URL: http://www.farnell.com/datasheets/2048008.pdf?src-supplier=Newark; ComponentLink6Description: http://www.farnell.com/datasheets/2048008.pdf?src-supplier=Newark; ComponentLink7URL: https://search.murata.co.jp/Ceramy/image/img/A01X/G101/ENG/GRM155R71E104KE14-01.pdf?src-supplier=Digi-Key; ComponentLink7Description: https://search.murata.co.jp/Ceramy/image/img/A01X/G101/ENG/GRM155R71E104KE14-01.pdf?src-supplier=Digi-Key; ComponentLink8URL: http://www.farnell.com/datasheets/2048008.pdf?src-supplier=Element14; ComponentLink8Description: http://www.farnell.com/datasheets/2048008.pdf?src-supplier=Element14; ComponentLink9URL: http://psearch.en.murata.com/capacitor/product/GRM155R71E104KE14%23.pdf?src-supplier=Avnet; ComponentLink9Description: http://psearch.en.murata.com/capacitor/product/GRM155R71E104KE14%23.pdf?src-supplier=Avnet; Manufacturer Part Number: GRM155R71E104KE14D
J1 = TAG_CONN_CTX: Mates with TC-2030-CTX-NL; house_part_number: type-value-case-grade
L1 L6 = L0402-7n5-Multilayer_Murata: Inductor, 550mA, ±2%, 240mΩ; Manufacturer: Murata; Manufacturer Part Number: LQG15HS7N5G02D; Part number NEMS: 100300446; Component Status: Active; Pad Count: 2; Note: -55°C ~ 125°C; Artikkelnr Noca: N.A.; Part Number: L0402-7n5-Multilayer_Murata; Component Class: Inductors; Author: hany; ComponentLink1URL: https://search.murata.co.jp/Ceramy/image/img/P02/JELF243B-0010.pdf; ComponentLink1Description: Datasheet; ComponentLink2URL: N.A.; ComponentLink2Description: Supplier link; HelpURL: https://search.murata.co.jp/Ceramy/image/img/P02/JELF243B-0010.pdf; LatestRevisionDate: 2023-06-06; Published: 2023-06-06; Supplier 1: Digi-Key; Supplier Part Number 1: 490-LQG15HS7N5G02DTR-ND; Supplier 2: Mouser; Supplier Part Number 2: 81-LQG15HS7N5J02D; Part number IPS: N.A.; Part number Norautron: N.A.; PartId: 100300446
L2 = DFE252012F-3R3M=P2: 3.3 μH, 1.8 A, 1008 Inductor; Manufacturer: Murata; house_part_number: L-3.3uH-1008-002; Core Material: Ferrite; Current Rating: 1.8A; Saturation Current: 2.8A; Shielding: Shielded; DC Resistance (DCR): 135mR; Test Frequency: 1MHz; Tolerance: 20%; Supplier Part Number 1: DFE252012F-3R3M=P2; RoHS: Yes; Category: Fixed Inductors; Stock: 8; Pricing: 1=0.1101 (USD); Mounting Technology: Surface Mount; Case/Package: 1008; Case Code (Metric): 2520; Min Operating Temperature: -40°C; Max Operating Temperature: 125°C; Packaging: Cut Tape; Series: DFE252012F; Length: 0.098inch; Width: 0.079inch; Height - Seated (Max): 0.047inch; RoHS Compliant: Yes; ComponentLink1URL: http://www.murata.com/~/media/webrenewal/products/inductor/chip/tokoproducts/wirewoundmetalalloychiptype/m_dfe252012f.ashx?src-supplier=Digikey; ComponentLink1Description: http://www.murata.com/~/media/webrenewal/products/inductor/chip/tokoproducts/wirewoundmetalalloychiptype/m_dfe252012f.ashx?src-supplier=Digikey; ComponentLink2URL: https://www.murata.com/~/media/webrenewal/products/inductor/chip/tokoproducts/wirewoundmetalalloychiptype/m_dfe252012f.ashx?src-supplier=Digikey; ComponentLink2Description: https://www.murata.com/~/media/webrenewal/products/inductor/chip/tokoproducts/wirewoundmetalalloychiptype/m_dfe252012f.ashx?src-supplier=Digikey; ComponentLink3URL: https://datasheet.octopart.com/DFE252012F-3R3M%3DP2-Murata-datasheet-150009032.pdf?src-supplier=Arrow.cn; ComponentLink3Description: https://datasheet.octopart.com/DFE252012F-3R3M%3DP2-Murata-datasheet-150009032.pdf?src-supplier=Arrow.cn; Supplier 1: Arrow Electronics; Manufacturer Part Number: DFE252012F-3R3M=P2
L5 L7 = L0402-2n7-Multilayer_Murata: Inductor, 800mA, ±2%, 120mΩ; Manufacturer: Murata; Manufacturer Part Number: LQG15HS2N7B02D; Part number NEMS: 100300445; Component Status: Active; Pad Count: 2; Note: -55°C ~ 125°C; Artikkelnr Noca: N.A.; Part Number: L0402-2n7-Multilayer_Murata; Component Class: Inductors; Author: hany; ComponentLink1URL: https://search.murata.co.jp/Ceramy/image/img/P02/JELF243B-0010.pdf; ComponentLink1Description: Datasheet; ComponentLink2URL: N.A.; ComponentLink2Description: Supplier link; HelpURL: https://search.murata.co.jp/Ceramy/image/img/P02/JELF243B-0010.pdf; LatestRevisionDate: 2023-06-06; Published: 2023-06-06; Supplier 1: Digi-Key; Supplier Part Number 1: 490-LQG15HS2N7B02DTR-ND; Supplier 2: Mouser; Supplier Part Number 2: 81-LQG15HS2N7B02D; Part number IPS: N.A.; Part number Norautron: N.A.; PartId: 100300445
M1 = BT40: Bluetooth Module: 802.15.1 BLE 5.1, 802.15.4, nRF5340, PCB trace antenna; Manufacturer: Fanstel; Supplier: Digikey; Supplier Part Number: 1914-BT40CT-ND; RoHS: No; Stock: 407; Pricing: 1=13.74, 10=12.435, 25=11.4536, 100=10.4717, 250=9.8172, 500=9.16272 (USD); Supplier 1: Digikey; Supplier Part Number 1: 1914-BT40CT-ND; Manufacturer Part Number: BT40
Q9 = AO3415A: P-FET, 30V, 6A, SOT-23-3; Manufacturer: Alpha & Omega Semiconductor; Rds On Max: 45mΩ; Input Capacitance: 940pF; Drain to Source Voltage (Vdss): 20V; Continuous Drain Current (ID): 5A; Max Power Dissipation: 1.5W; Threshold Voltage: 8mV; Turn-Off Delay Time: 19ps; Turn-On Delay Time: 13ps; Supplier: Arrow Electronics; Supplier Part Number: AO3415A; RoHS: Yes; Category: MOSFETs; Stock: 21000; Pricing: 3000=0.3033, 6000=0.3003, 9000=0.2972, 15000=0.2942, 24000=0.2912, 30000=0.2881 (USD); Mounting Technology: Surface Mount; Pins: 3; Min Operating Temperature: -55°C; Max Operating Temperature: 150°C; Series: -; Packaging: Cut Tape; RoHS Compliant: Yes; ComponentLink1URL: https://datasheet.ciiva.com/940/ao3415-940752.pdf?src-supplier=Digikey; ComponentLink1Description: https://datasheet.ciiva.com/940/ao3415-940752.pdf?src-supplier=Digikey; ComponentLink2URL: https://datasheet.ciiva.com/940/ao3415-940753.pdf?src-supplier=Digikey; ComponentLink2Description: https://datasheet.ciiva.com/940/ao3415-940753.pdf?src-supplier=Digikey; Manufacturer Part Number: AO3415A; Supplier 1: LCSC; Supplier Part Number 1: C133233; house_part_number: AO3415A
R8 R9 = RC0402FR-072K2L: 2.2 kΩ, 0402 Chip resistor; Manufacturer: Yageo; house_part_number: R-2.2k-0402-1%-001; Tolerance: 1%; Power Rating: 62.5mW; Voltage Rating: 50V; Temperature Coefficient: 100ppm/°C; Max Power Dissipation: 63mW; Manufacturer Part Number: RC0402FR-072K2L; RoHS: Yes; Category: Chip SMD Resistors; Stock: 4866; Pricing: 1=0.1, 20=0.0673, 150=0.0454, 1000=0.0247, 5000=0.0072 (USD); Case Code (Imperial): 0402; Case Code (Metric): 1005; Weight: 2.3E-05oz; Min Operating Temperature: -55°C; Max Operating Temperature: 155°C; Resistor Type: Thick Film; Packaging: Tape and Reel; Termination: SMD/SMT; Features: Moisture Resistant; Series: RC; Number of Terminations: 2; Resistance Tolerance: 1%; Construction: Rectangular; Technology: THICK FILM; Voltage Rating (AC): 50V; Length: 1mm; Width: 0.5mm; Height: 0.35mm; Depth: 0.5mm; RoHS Compliant: Yes; Reach SVHC Compliant: No; Military Standard: Not; Lead Free: Lead Free; ComponentLink1URL: https://datasheet.ciiva.com/11808/0900766b80c66297-11808786.pdf?src-supplier=Rs; ComponentLink1Description: https://datasheet.ciiva.com/11808/0900766b80c66297-11808786.pdf?src-supplier=Rs; ComponentLink2URL: https://datasheet.ciiva.com/7983/1018594-7983515.pdf?src-supplier=Element14; ComponentLink2Description: https://datasheet.ciiva.com/7983/1018594-7983515.pdf?src-supplier=Element14; ComponentLink3URL: https://datasheet.ciiva.com/12577/pyu-rc0402-51-rohs-l-6-r-12577429.pdf?src-supplier=Mouser; ComponentLink3Description: https://datasheet.ciiva.com/12577/pyu-rc0402-51-rohs-l-6-r-12577429.pdf?src-supplier=Mouser; ComponentLink4URL: https://datasheet.ciiva.com/46383/1018594-46383563.pdf?src-supplier=Element14; ComponentLink4Description: https://datasheet.ciiva.com/46383/1018594-46383563.pdf?src-supplier=Element14; ComponentLink5URL: https://datasheet.ciiva.com/7849/1018594-7849929.pdf?src-supplier=Element14; ComponentLink5Description: https://datasheet.ciiva.com/7849/1018594-7849929.pdf?src-supplier=Element14; ComponentLink6URL: https://datasheet.ciiva.com/7849/1018594-7849928.pdf?src-supplier=Element14; ComponentLink6Description: https://datasheet.ciiva.com/7849/1018594-7849928.pdf?src-supplier=Element14; ComponentLink7URL: https://datasheet.ciiva.com/16741/pyu-rc0402-51-rohs-l-6-r-16741015.pdf?src-supplier=Future+Electronics; ComponentLink7Description: https://datasheet.ciiva.com/16741/pyu-rc0402-51-rohs-l-6-r-16741015.pdf?src-supplier=Future+Electronics; Supplier 1: Future Electronics; Supplier Part Number 1: 9737263
R10 R11 = RC0402FR-070RL: 0 Ω, 0402 Chip resistor (jumper); Manufacturer: Yageo; house_part_number: R-0-0402-1%-001; Tolerance: 1%; Temperature Coefficient: 200ppm/°C; Voltage Rating: 50V; Power Rating: 62.5mW; Max Power Dissipation: 63mW; Supplier 1: Avnet; Supplier Part Number 1: RC0402FR-070RL; RoHS: Yes; Category: Chip SMD Resistors; Min Operating Temperature: -55°C; Max Operating Temperature: 155°C; Packaging: Tape and Reel; Termination: SMD/SMT; RoHS Compliant: Yes; Manufacturer Part Number: RC0402FR-070RL; Stock: 580000; Pricing: 10000=0.00093 (USD); Mounting Technology: Surface Mount; Contact Plating: Tin,Matte; Case Code (Imperial): 0402; Case Code (Metric): 1005; Features: Moisture Resistant; Series: RC; Number of Terminations: 2; Length: 1mm; Width: 0.5mm; Height: 0.35mm; Lead Free: 5697LeadFree
R22 = RC0402FR-070RL: 0 Ω, 0402 Chip resistor (jumper); Manufacturer: Yageo; house_part_number: R-0-0402-1%-001; Voltage Rating: 50V; Tolerance: 1%; Power Rating: 62.5mW; Temperature Coefficient: 200ppm/°C; Max Power Dissipation: 63mW; Manufacturer Part Number: RC0402FR-070RL; Supplier 1: Avnet; Supplier Part Number 1: RC0402FR-070RL; RoHS: Yes; Category: Chip SMD Resistors; Stock: 580000; Pricing: 10000=0.00093 (USD); Mounting Technology: Surface Mount; Contact Plating: Tin,Matte; Case Code (Imperial): 0402; Case Code (Metric): 1005; Min Operating Temperature: -55°C; Max Operating Temperature: 155°C; Packaging: Tape and Reel; Termination: SMD/SMT; Features: Moisture Resistant; Series: RC; Number of Terminations: 2; Length: 1mm; Width: 0.5mm; Height: 0.35mm; RoHS Compliant: Yes; Lead Free: 5697LeadFree
R46 = RC0402FR-075K1L: 5.1 kΩ, 0402 Chip resistor; Manufacturer: Yageo; house_part_number: R-5.1k-0402-1%-001; Power Rating: 63mW; Tolerance: 1%; Temperature Coefficient: 100ppm/°C; Voltage Rating: 50V; Manufacturer Part Number: RC0402FR-075K1L; RoHS: Yes; Category: Chip SMD Resistors; Stock: 1190000; Pricing: 10000=0.0024, 50000=0.0023, 250000=0.0021, 500000=0.0021, 1500000=0.0019 (USD); Case Code (Metric): 1005; Case Code (Imperial): 0402; Min Operating Temperature: -55°C; Max Operating Temperature: 155°C; Technology: THICK FILM; Packaging: Tape and Reel; Package Quantity: 1; Resistor Type: Thick Film; Number of Terminations: 2; Termination: SMD/SMT; Max Power Dissipation: 63mW; Working Voltage: 50V; Features: Moisture Resistant; Series: RC; Resistance Tolerance: 1%; Construction: Rectangular; Voltage Rating (DC): 50V; Length: 1mm; Width: 0.02inch; Height: 0.016inch; Depth: 0.5mm; RoHS Compliant: Yes; Military Standard: Not; Reach SVHC Compliant: Unknown; Lead Free: 5697LeadFree; ComponentLink1URL: https://datasheet.ciiva.com/7983/1018594-7983519.pdf?src-supplier=Element14; ComponentLink1Description: https://datasheet.ciiva.com/7983/1018594-7983519.pdf?src-supplier=Element14; ComponentLink2URL: https://datasheet.ciiva.com/46394/1018594-46394936.pdf?src-supplier=Element14; ComponentLink2Description: https://datasheet.ciiva.com/46394/1018594-46394936.pdf?src-supplier=Element14; ComponentLink3URL: https://datasheet.ciiva.com/2453/pyu-r-int-thick-7-2453401.pdf?src-supplier=Digikey; ComponentLink3Description: https://datasheet.ciiva.com/2453/pyu-r-int-thick-7-2453401.pdf?src-supplier=Digikey; ComponentLink4URL: https://datasheet.ciiva.com/2453/pyu-r-int-thick-7-2453402.pdf?src-supplier=Digikey; ComponentLink4Description: https://datasheet.ciiva.com/2453/pyu-r-int-thick-7-2453402.pdf?src-supplier=Digikey; ComponentLink5URL: https://datasheet.ciiva.com/2453/pyu-r-int-thick-7-2453400.pdf?src-supplier=Digikey; ComponentLink5Description: https://datasheet.ciiva.com/2453/pyu-r-int-thick-7-2453400.pdf?src-supplier=Digikey; ComponentLink6URL: https://datasheet.ciiva.com/12558/pyu-rc0402-51-rohs-l-6-r-8721-12558460.pdf?src-supplier=Mouser; ComponentLink6Description: https://datasheet.ciiva.com/12558/pyu-rc0402-51-rohs-l-6-r-8721-12558460.pdf?src-supplier=Mouser; ComponentLink7URL: https://datasheet.ciiva.com/16744/pyu-rc0402-51-rohs-l-6-r-16744283.pdf?src-supplier=Future+Electronics; ComponentLink7Description: https://datasheet.ciiva.com/16744/pyu-rc0402-51-rohs-l-6-r-16744283.pdf?src-supplier=Future+Electronics; ComponentLink8URL: https://datasheet.ciiva.com/15189/getdatasheetpartid-323636-15189493.pdf?src-supplier=Verical; ComponentLink8Description: https://datasheet.ciiva.com/15189/getdatasheetpartid-323636-15189493.pdf?src-supplier=Verical; Supplier 1: Future Electronics; Supplier Part Number 1: 6053649
R47 = RC0402JR-071KL: 1 kΩ, 0402 Chip resistor; Manufacturer: Yageo; house_part_number: R-1k-0402-1%-001; Tolerance: 5%; Temperature Coefficient: 100ppm/°C; Voltage Rating: 50V; Power Rating: 62.5mW; Max Power Dissipation: 63mW; Manufacturer Part Number: RC0402JR-071KL; RoHS: Yes; Category: Chip SMD Resistors; Min Operating Temperature: -55°C; Max Operating Temperature: 155°C; Resistor Type: Thick Film; Packaging: Cut Tape; Termination: SMD/SMT; RoHS Compliant: Yes; ComponentLink1URL: https://datasheet.ciiva.com/7983/1018594-7983558.pdf?src-supplier=Element14; ComponentLink1Description: https://datasheet.ciiva.com/7983/1018594-7983558.pdf?src-supplier=Element14; ComponentLink2URL: https://datasheet.ciiva.com/2452/pyu-r-int-thick-7-2452756.pdf?src-supplier=Digikey; ComponentLink2Description: https://datasheet.ciiva.com/2452/pyu-r-int-thick-7-2452756.pdf?src-supplier=Digikey; ComponentLink3URL: https://datasheet.ciiva.com/2452/pyu-r-int-thick-7-2452757.pdf?src-supplier=Digikey; ComponentLink3Description: https://datasheet.ciiva.com/2452/pyu-r-int-thick-7-2452757.pdf?src-supplier=Digikey; ComponentLink4URL: https://datasheet.ciiva.com/2452/pyu-r-int-thick-7-2452755.pdf?src-supplier=Digikey; ComponentLink4Description: https://datasheet.ciiva.com/2452/pyu-r-int-thick-7-2452755.pdf?src-supplier=Digikey; ComponentLink5URL: https://datasheet.ciiva.com/7850/1018594-7850170.pdf?src-supplier=Element14; ComponentLink5Description: https://datasheet.ciiva.com/7850/1018594-7850170.pdf?src-supplier=Element14; Stock: 15490862; Pricing: 1=0.1, 10=0.018, 50=0.0102, 100=0.0083, 500=0.00528, 1000=0.00444, 5000=0.00307 (USD); Case Code (Imperial): 0402; Case Code (Metric): 1005; Series: RC; Voltage Rating (AC): 50V; Package Quantity: 1; Number of Terminations: 2; Features: Moisture Resistant; Resistance Tolerance: 5%; Length: 0.039inch; Width: 0.02inch; Height: 0.016inch; Reach SVHC Compliant: No; Lead Free: 5697LeadFree; ComponentLink6URL: https://datasheet.ciiva.com/7850/1018594-7850171.pdf?src-supplier=Element14; ComponentLink6Description: https://datasheet.ciiva.com/7850/1018594-7850171.pdf?src-supplier=Element14; ComponentLink7URL: https://datasheet.ciiva.com/17081/pyu-rc0402-51-rohs-l-6-r-17081438.pdf?src-supplier=Future+Electronics; ComponentLink7Description: https://datasheet.ciiva.com/17081/pyu-rc0402-51-rohs-l-6-r-17081438.pdf?src-supplier=Future+Electronics; Supplier 1: Digikey; Supplier Part Number 1: 311-1.0KJRCT-ND
SAW1 = LFD182G45DCJD247: Murata Manufacturing Co., Ltd. SMD; Supplier: Mouser; Supplier Part Number: 81-LFD182G45DCJD247; Manufacturer: Murata; RoHS: No; Category: LDO; Stock: 11421; Pricing: 1=0.47, 10=0.332, 50=0.332, 100=0.308, 1000=0.217, 10000=0.192 (USD); Manufacturer Part Number: LFD182G45DCJD247
TP1 TP3 TP18-TP21 TP25-TP27 TP29-TP46 TP69 = test_point-1: Test point; pickable: no
U1 = NRF7002-QFAA-R: Wi-Fi 6 Module IEEE 802.11a/b/g/n/ac/ax DSSS/CCK/HT 2.4GHz/5GHz 86Mbps 48-Pin QFN EP T/R; Manufacturer: Nordic Semiconductor; Supplier: Newark; Supplier Part Number: 70AK6756; RoHS: No; Stock: 8361; Pricing: 1=5.13, 10=4.94, 25=4.75, 50=4.56, 100=4.37, 250=4.09, 500=3.8, 1000=3.47 (USD); Manufacturer Part Number: NRF7002-QFAA-R
X2 = Q40,0-JXS11-8-10/10-FU-LF: Crystal 40.0000MHZ 8PF SMD; Manufacturer: Jauch; Manufacturer Part Number: Q40,0-JXS11-8-10/10-FU-LF; Supplier: Digikey; Supplier Part Number: 1908-Q400-JXS11-8-10/10-FU-LFCT-ND; RoHS: No; Stock: 7747; Pricing: 1=0.79, 10=0.68, 50=0.6134, 100=0.5867, 500=0.52924, 1000=0.40109, 2000=0.3838, 3000=0.37405, 5000=0.36214, 7000=0.35452, 10000=0.35375 (USD)